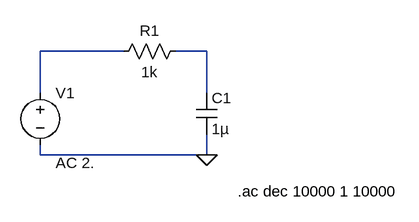
[diagram p0: schematic Low_Pass_Gain.asc]
Low_Pass_Gain.asc, the LTspice schematic file:
Version 4.1
SHEET 1 880 680
WIRE 96 112 -32 112
WIRE 224 112 176 112
WIRE -32 176 -32 112
WIRE 224 176 224 112
WIRE -32 272 -32 256
WIRE 224 272 224 240
WIRE 224 272 -32 272
FLAG 224 272 0
SYMBOL voltage -32 160 R0
WINDOW 123 24 124 Left 2
WINDOW 39 0 0 Left 0
SYMATTR Value2 AC 2.
SYMATTR InstName V1
SYMATTR Value ""
SYMBOL res 192 96 R90
WINDOW 0 0 56 VBottom 2
WINDOW 3 32 56 VTop 2
SYMATTR InstName R1
SYMATTR Value 1k
SYMBOL cap 208 176 R0
SYMATTR InstName C1
SYMATTR Value 1µ
TEXT 272 328 Left 2 !.ac dec 10000 1 10000

The netlist it stands for:
* Low_Pass_Gain.asc
V1 N001 0 AC 2.
R1 N002 N001 1k
C1 N002 0 1µ
.ac dec 10000 1 10000
.backanno
.end